# EAGLE design Slave (EAGLE 9.6.2)
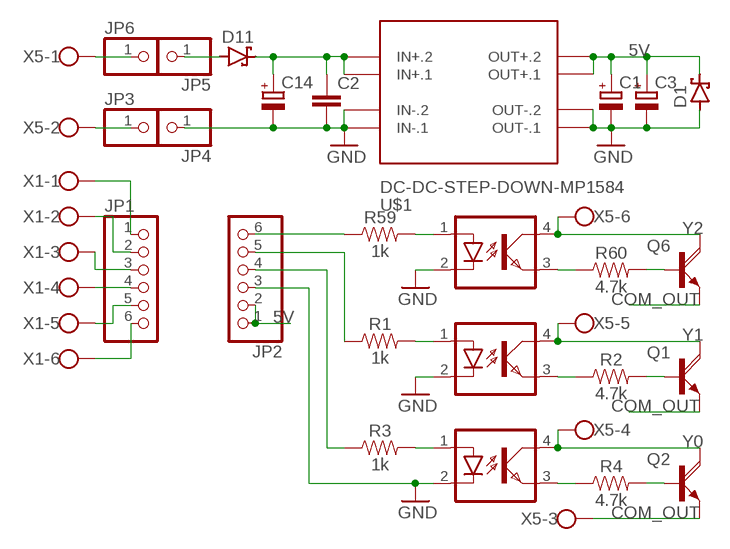
[diagram p0: schematic, sheet 1]

## Parts
C1  CPOL-EUE2.5-7  [E2,5-7]
C2  C-EUC1206K  [C1206K]
C3  CPOL-EUE2.5-7  [E2,5-7]
C14  CPOL-EUE2.5-7  [E2,5-7]
D1  SCHOTTKY-DIODESMD  [SMB]
D11  SCHOTTKY-DIODESMD  [SMB]
JP1  PINHD-1X6B  [1X06-BIG]
JP2  PINHD-1X6B  [1X06-BIG]
JP3  PINHD-1X1  [1X01]
JP4  PINHD-1X1  [1X01]
JP5  PINHD-1X1  [1X01]
JP6  PINHD-1X1  [1X01]
OK1  PC817  [DIL04]
OK2  PC817  [DIL04]
OK14  PC817  [DIL04]
Q1  TIP120V  [TO220AV]
Q2  TIP120V  [TO220AV]
Q6  TIP120V  [TO220AV]
R1  1k  0.75OHM-0805-1/4W-1%  [0805]
R2  4.7k  0.75OHM-0805-1/4W-1%  [0805]
R3  1k  0.75OHM-0805-1/4W-1%  [0805]
R4  4.7k  0.75OHM-0805-1/4W-1%  [0805]
R59  1k  0.75OHM-0805-1/4W-1%  [0805]
R60  4.7k  0.75OHM-0805-1/4W-1%  [0805]
U$1  DC-DC-STEP-DOWN-MP1584  [DC-DC-STEP-DOWN-MP1584]
X1  W237-136  [W237-136]
X5  W237-136  [W237-136]

## Nets
5V: C1.+ C3.+ D1.C JP2.1 JP2.2 U$1.OUT+.1 U$1.OUT+.2
COM_OUT: Q1.E Q2.E Q6.E X5.3
GND: C1.- C2.2 C3.- C14.- D1.A JP2.3 JP4.1 OK1.2(C) OK2.2(C) OK14.2(C) U$1.IN-.1 U$1.IN-.2 U$1.OUT-.1 U$1.OUT-.2
N$1: OK1.3(EMIT) R2.1
N$2: OK1.1(A) R1.2
N$3: Q1.B R2.2
N$4: OK2.3(EMIT) R4.1
N$5: OK2.1(A) R3.2
N$6: Q2.B R4.2
N$7: JP1.6 X1.6
N$8: JP1.5 X1.5
N$9: JP1.4 X1.4
N$10: JP1.3 X1.3
N$11: JP1.2 X1.2
N$12: JP1.1 X1.1
N$13: JP2.6 R59.1
N$14: JP2.5 R1.1
N$15: JP2.4 R3.1
N$16: D11.A JP5.1
N$18: JP3.1 X5.2
N$19: JP6.1 X5.1
N$22: C2.1 C14.+ D11.C U$1.IN+.1 U$1.IN+.2
N$92: OK14.3(EMIT) R60.1
N$94: OK14.1(A) R59.2
N$97: Q6.B R60.2
Y0: OK2.4(COL) Q2.C X5.4
Y1: OK1.4(COL) Q1.C X5.5
Y2: OK14.4(COL) Q6.C X5.6

## Library data of the parts
C1 C3 C14 = rcl:CPOL-EU: POLARIZED CAPACITOR, European symbol; SPICEPREFIX: C
C2 = rcl:C-EU: CAPACITOR, European symbol; SPICEPREFIX: C
D1 D11 = diode:SCHOTTKY-DIODE: Schottky Diode
JP1 JP2 = adafruit:PINHD-1X6: PIN HEADER
JP3-JP6 = adafruit:PINHD-1X1: Pin header 1x1 for 0.1" spacing With round pins
OK1 OK2 OK14 = optocoupler:PC817: SHARP OPTO COUPLER; MPN: PC817X4J000F; OC_FARNELL: 9707727; OC_NEWARK: 97K7059
Q1 Q2 Q6 = rocketfarm:TIP120: NPN DARLINGTON TRANSISTOR
R1-R4 R59 R60 = SparkFun-Resistors:0.75OHM: 0.75Ω resistor A resistor is a passive two-terminal electrical component that implements electrical resistance as a circuit element. Resistors act to reduce current flow, and, at the same time, act to lower voltage levels within circuits. - Wikipedia; PROD_ID: RES-08474; VALUE: 0.75
U$1 = diy-modules:DC-DC-STEP-DOWN-MP1584: DC/DC Step-Down Regulator based on MP1584 chip MP1584 datasheet available here: http://www.haoyuelectronics.com/Attachment/MP1584/MP1584.pdf Click here to find device on ebay.com <http://www.ebay.com/sch/mp1584+module>
X1 X5 = con-wago-500:W237-136: WAGO SCREW CLAMP; MPN: 237-136; OC_FARNELL: unknown; OC_NEWARK: 84K9151

## Board
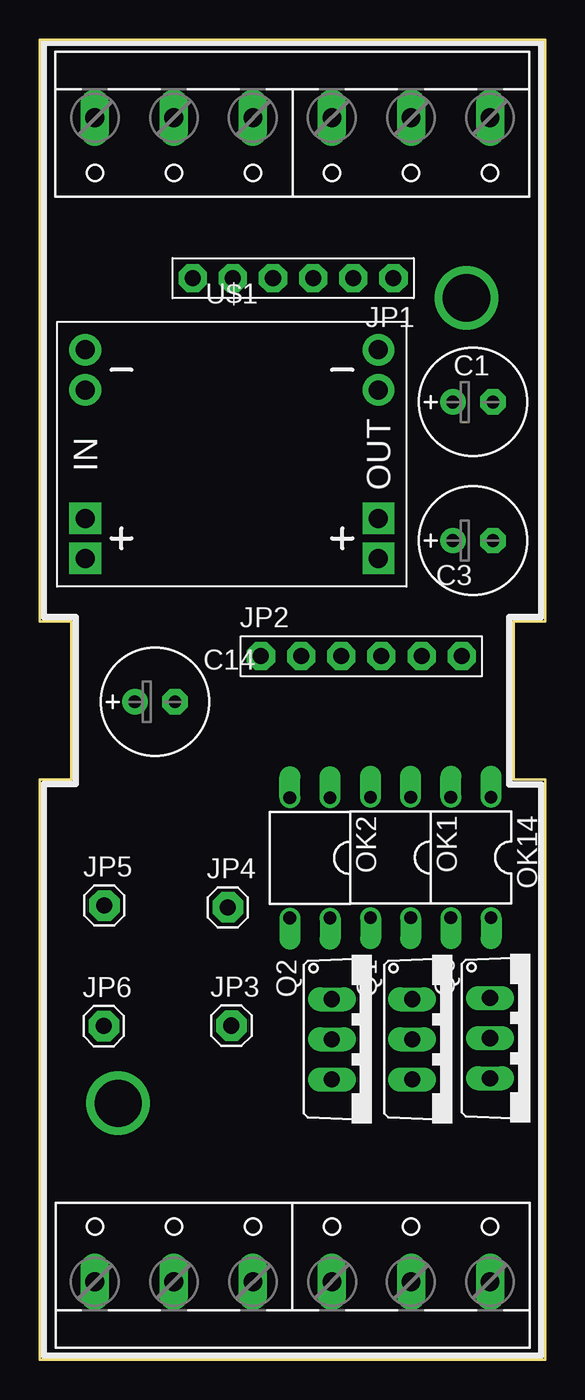
[diagram p1: board, top side]
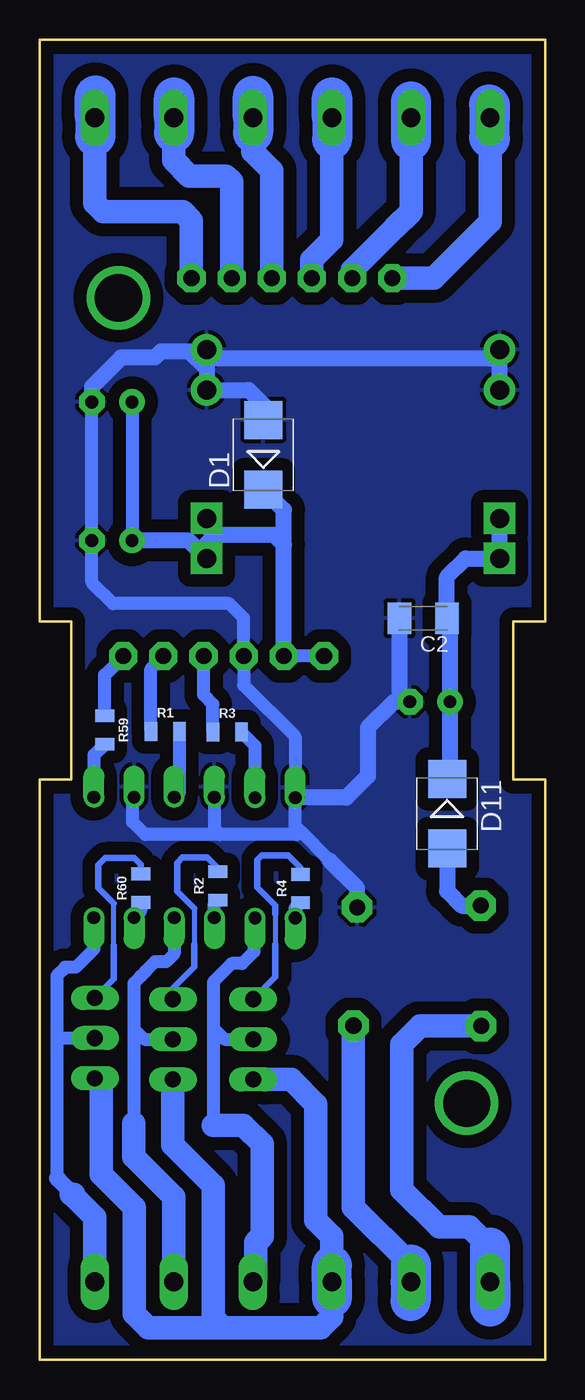
[diagram p2: board, bottom side, seen from below]

Size 32 x 83.57 mm. Coordinates in mm from the lower left corner, seen from the top.
Outline: 0,0 32,0 32,36.73 30,36.73 30,46.75 32,46.75 32,83.57 0.01,83.57 0.01,46.74 2.02,46.74 2.02,36.73 0,36.73 0,0
Copper layers (1*16): Top 0.035mm / dielectric 1.5mm / Bottom 0.035mm
Design rules "default *": minimum track width 6mil, minimum drill 0.35mm, track to track 3mil, track to pad 3mil, pad to pad 3mil, via to via 3mil, smd to smd 3mil, copper to edge 24mil, drill to drill 6mil, minimum pad ring 10mil, minimum via ring 8mil, stop-mask expansion 4mil, vias tented up to drill 0mil, thermal gap 10mil

### Footprints (pad centres in the part's own frame; a part is rotated, then mirrored left to right if it is on the bottom)
E2,5-7 = drill 0.813 pad 1.6: + -1.27,0 | drill 0.813 pad 1.6 octagon: - 1.27,0
C1206K = smd 1.5 x 2: 1 -1.5,0; 2 1.5,0
SMB = smd 2.4 x 2.4: A 2.2,0; C -2.2,0
1X06-BIG = drill 1.016 pad 1.778 octagon: 1 -6.35,0; 2 -3.81,0; 3 -1.27,0; 4 1.27,0; 5 3.81,0; 6 6.35,0
1X01 = drill 1.016 pad 1.93 octagon: 1 0,0
DIL04 = drill 0.813 offset: 1 -1.27,-3.81; 2 1.27,-3.81; 3 1.27,3.81; 4 -1.27,3.81
TO220AV = drill 1.016 long: B -2.54,-2.54; C 0,-2.54; E 2.54,-2.54
0805 = smd 0.8 x 1.2: 1 -0.9,0; 2 0.9,0
DC-DC-STEP-DOWN-MP1584 = drill 1.2 pad 2 square: IN+.1 -9.271,-4.064; IN+.2 -9.271,-6.604; OUT+.1 9.271,-4.064; OUT+.2 9.271,-6.604 | drill 1.2 pad 2: IN-.1 -9.271,6.604; IN-.2 -9.271,4.064; OUT-.1 9.271,6.604; OUT-.2 9.271,4.064
W237-136 = drill 1.194 long: 1 -12.5,-1.27; 2 -7.5,-1.27; 3 -2.5,-1.27; 4 2.5,-1.27; 5 7.5,-1.27; 6 12.5,-1.27

### Placement (x,y rotation side)
C1  27.42,60.63 0 top
C2  7.73,46.94 180 bottom
C3  27.42,51.85 0 top
C14  7.3,41.66 0 top
D1  17.84,57.29 90 bottom
D11  6.22,34.58 270 bottom
JP1  16.04,68.47 180 top
JP2  20.36,44.54 0 top
JP3  12.14,21.16 0 top
JP4  11.91,28.65 0 top
JP5  4.1,28.77 0 top
JP6  4.06,21.13 0 top
OK1  22.21,31.8 180 top
OK2  17.11,31.78 180 top
OK14  27.29,31.8 180 top
Q1  26.11,20.29 270 top
Q2  21.03,20.29 270 top
Q6  31.04,20.37 270 top
R1  24.05,39.76 0 bottom
R2  20.73,30 90 bottom
R3  20.13,39.74 0 bottom
R4  15.49,29.83 90 bottom
R59  27.89,39.87 270 bottom
R60  25.6,29.86 90 bottom
U$1  12.17,57.33 0 top
X1  16,77.34 180 top
X5  16,6.22 0 top

### Tracks (layer width: path | path; a pad name or v marks a point on that pad's centre or on a via)
5V
  Bottom 0.813: JP2.2 JP2.1 14.33,44.86 | C1.+ C3.+
  Bottom 1.016: JP2.2 16.55,51.6 | 16.55,51.6 16.55,53.79 D1.C | 16.55,51.6 17.16,52.21 20.89,52.21 | 20.89,52.21 21.44,52.76 U$1.OUT+.1 | 20.89,52.21 21.44,51.66 U$1.OUT+.2 22.57,51.85 C3.+
COM_OUT
  Bottom 0.813: Q2.E 17.04,17.75 | 28.51,17.82 Q6.E
  Bottom 1.5: Q2.E 16.09,17.75 14.53,16.19 14.53,8.84 13.5,7.81 13.5,5.97 | 13.5,3.95 13.5,2.74 14.21,2.03 20.37,2.03 | Q1.E 23.57,13.61 21.01,11.05 21.01,2.67 20.37,2.03 | Q6.E 28.09,17.42 28.09,11.73 26.01,9.65 26.01,2.92 25.12,2.03 20.37,2.03
  Bottom 2.54: 13.5,5.97 X5.3 13.5,3.95
GND
  Bottom 0.813: 13.64,31.6 15.52,33.48 | 15.52,33.48 15.84,33.79 OK2.2 15.84,39.45 19.09,42.7 JP2.3 19.09,46.96 19.99,47.87 27.34,47.87 28.69,49.21 C3.- C1.- | 15.52,33.48 15.75,33.25 20.57,33.25 | OK14.2 26.11,35.52 26.11,34.05 25.31,33.25 20.57,33.25 | OK1.2 20.94,33.62 20.57,33.25
  Bottom 1.016: U$1.OUT-.1 21.44,63.36 | 21.44,63.36 21.44,62.74 | 21.44,62.74 U$1.OUT-.2 18.78,61.39 17.77,60.38 17.77,59.57 D1.A | 21.44,62.74 22.52,63.82 24.33,63.82 24.71,63.44 26.84,63.44 28.69,61.58 C1.- | U$1.IN-.2 U$1.IN-.1 3.47,63.36 21.44,63.36 | JP4.1 11.91,29.87 13.64,31.6 | C2.2 9.23,42.32 C14.- 9.59,41.66 11.23,40.02 11.23,36.94 12.59,35.59 OK2.2
  pour Bottom (isolate 0.813): 32,83.57 32,46.75 30,46.75 30,36.73 32,36.73 32,0 0,0 0,36.73 2.02,36.73 2.02,46.75 -0.01,46.75 0.01,83.55 0.03,83.54 0.01,83.57 0.01,83.58 0.03,83.55
N$1
  Bottom 0.813: OK1.3 20.94,28.88 R2.1
N$2
  Bottom 0.813: R1.2 23.15,35.94 OK1.1
N$3
  Bottom 0.305: 22.21,28.56 22.21,26.3
  Bottom 0.406: R2.2 20.73,31.14 21.4,31.81 22.96,31.81 23.3,31.47 23.3,29.65 22.21,28.56 | Q1.B 23.57,23.52 22.21,24.88 22.21,26.3
N$4
  Bottom 0.813: OK2.3 15.84,28.59 R4.1
N$5
  Bottom 0.813: R3.2 18.38,38.89 OK2.1
N$6
  Bottom 0.305: 17.08,28.24 17.08,26.29
  Bottom 0.406: R4.2 15.49,31.17 16.26,31.93 17.95,31.93 18.22,31.65 18.22,29.92 17.08,28.78 17.08,28.24 | 17.08,26.29 17.08,24.24 Q2.B
N$7
  Bottom 1.5: 3.5,77.3 3.5,72.04 7.07,68.47 JP1.6
  Bottom 2.54: X1.6 3.5,79.4 3.57,79.46 3.57,77.37 3.5,77.3
N$8
  Bottom 1.5: 8.5,77.17 8.5,72.66 9.55,71.62 9.58,71.62 12.23,68.96 JP1.5
  Bottom 2.54: X1.5 8.5,79.63 8.51,79.64 8.51,77.17 8.5,77.17
N$9
  Bottom 1.5: JP1.4 14.77,69.62 13.5,70.89 13.5,77.25
  Bottom 2.54: X1.4 13.5,79.91 13.5,77.26 13.5,77.25
N$10
  Bottom 1.5: 18.5,77.66 18.5,76.46 17.31,75.27 JP1.3
  Bottom 2.54: X1.3 18.5,79.99 18.49,80 18.49,77.67 18.5,77.66
N$11
  Bottom 1.5: JP1.2 19.85,74.56 20.22,74.93 22.52,74.93 23.5,75.91 23.5,77.66
  Bottom 2.54: X1.2 23.5,79.89 23.48,79.91 23.48,77.68 23.5,77.66
N$12
  Bottom 1.5: JP1.1 22.39,72.11 22.94,72.66 27.97,72.66 28.5,73.19 28.5,77.43
  Bottom 2.54: X1.1 28.5,80.01 28.47,80.04 28.47,77.46 28.5,77.43
N$13
  Bottom 0.813: R59.1 27.89,43.36 JP2.6
N$14
  Bottom 0.813: R1.1 24.95,43.75 JP2.5
N$15
  Bottom 0.813: R3.1 21.03,41.49 21.63,42.09 JP2.4
N$16
  Bottom 1.016: D11.A 6.22,29.68 5.28,28.74 4.13,28.74 JP5.1
N$18
  Bottom 1.5: JP3.1 12.14,9.66 8.5,6.03
  Bottom 2.54: 8.5,6.03 X5.2 8.52,4.93 8.52,3.72
N$19
  Bottom 1.5: JP6.1 7.91,21.13 9.08,19.96 9.08,10.78 6.73,8.43 4.81,8.43 3.5,7.12
  Bottom 2.54: X5.1 3.5,3.38 3.51,3.38 3.51,7.12 3.5,7.12
N$20  (via drill 3 pad 0.1)
  other vias: 27.01,67.22
N$21  (via drill 3 pad 0.1)
  other vias: 4.98,16.24
N$22
  Bottom 1.016: D11.C 6.03,36.97 C14.+ 6.03,46.74 C2.1 6.23,49.54 5.05,50.72 U$1.IN+.2 U$1.IN+.1
N$92
  Bottom 0.813: R60.1 25.6,28.41 OK14.3
N$94
  Bottom 0.813: R59.2 28.56,38.29 OK14.1
N$97
  Bottom 0.305: 27.31,26.23 27.32,26.24 27.32,28.91
  Bottom 0.406: R60.2 25.6,31.36 26.01,31.76 27.85,31.76 28.28,31.33 28.28,29.87 27.32,28.91 | 27.31,26.23 27.29,26.21 27.29,24.12 Q6.B
Y0
  Bottom 0.813: OK2.4 18.44,27.9 18.44,25.83 19.19,25.08 19.85,25.08 21.01,23.93 21.01,21.01 | Q2.C 20.29,20.29 21.01,21.01 | 21.01,21.01 21.01,14.85
  Bottom 1.5: X5.4 18.31,5.14 18.31,7.44 17.92,7.84 17.92,13.67 19.1,14.85 21.01,14.85
Y1
  Bottom 0.813: OK1.4 23.48,25.7 23.99,25.2 24.71,25.2 25.31,24.6 25.31,24.56 25.59,24.28 | 25.59,24.28 25.63,24.28 | 25.59,24.28 26.04,23.84 26.04,20.95 | Q1.C 25.37,20.29 26.04,20.95 | 26.04,20.95 26.04,14.97
  Bottom 1.5: X5.5 23.5,10.33 26.04,12.86 26.04,14.97
Y2
  Bottom 0.813: OK14.4 28.56,26.03 28.55,26.02 29.72,24.85 30.39,24.85 30.91,24.33 30.91,20.65 | Q6.C 30.63,20.37 30.91,20.65 | 30.91,20.65 30.91,11.51
  Bottom 1.016: 30.91,11.51 30.81,11.4 30.77,11.4 29.85,10.48
  Bottom 1.5: X5.6 28.5,9.02 29.96,10.48 | 29.85,10.48 29.96,10.48 | 29.96,10.48 30,10.48